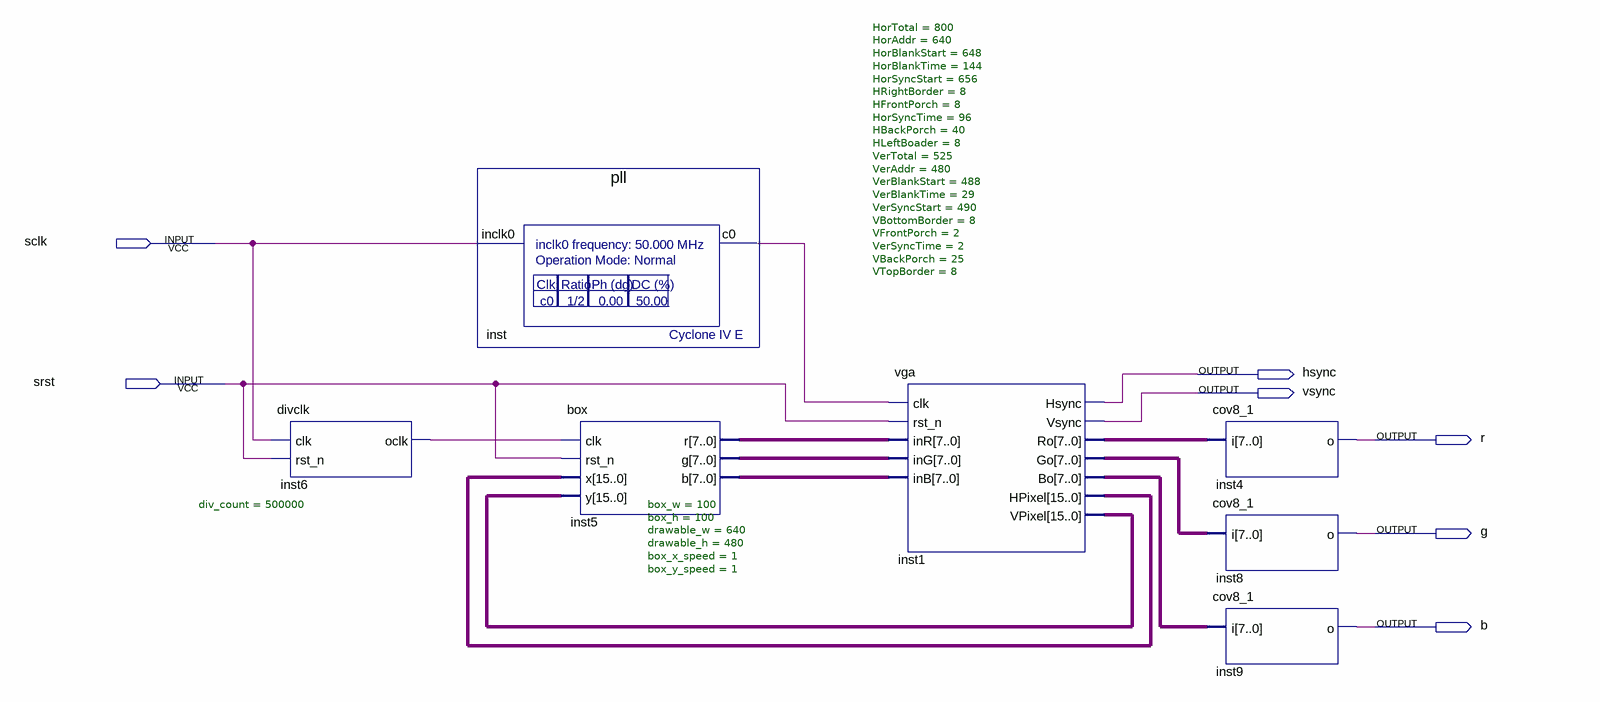
[diagram p0: schematic sheet]
// Quartus schematic box_move.bdf as structural Verilog: 7 symbols, 7 pins
module box_move (
  input  sclk,
  input  srst,
  output hsync,
  output vsync,
  output r,
  output g,
  output b
);

  wire inst6_oclk, inst_c0;
  wire [7:0] inst1_bo, inst1_go, inst1_ro, inst5_b, inst5_g, inst5_r;
  wire [15:0] inst1_hpixel, inst1_vpixel;

  divclk #(.div_count(500000)) inst6 (.clk(sclk), .rst_n(srst), .oclk(inst6_oclk));
  pll inst (.inclk0(sclk), .c0(inst_c0));
  box #(.box_w(100), .box_h(100), .drawable_w(640), .drawable_h(480), .box_x_speed(1), .box_y_speed(1)) inst5 (
    .clk(inst6_oclk), .rst_n(srst), .x(inst1_hpixel), .y(inst1_vpixel), .r(inst5_r), .g(inst5_g), .b(inst5_b));
  vga #(.HorTotal(800), .HorAddr(640), .HorBlankStart(648), .HorBlankTime(144), .HorSyncStart(656), .HRightBorder(8), .HFrontPorch(8), .HorSyncTime(96), .HBackPorch(40), .HLeftBoader(8), .VerTotal(525), .VerAddr(480), .VerBlankStart(488), .VerBlankTime(29), .VerSyncStart(490), .VBottomBorder(8), .VFrontPorch(2), .VerSyncTime(2), .VBackPorch(25), .VTopBorder(8)) inst1 (
    .clk(inst_c0), .rst_n(srst), .inR(inst5_r), .inG(inst5_g), .inB(inst5_b), .Hsync(hsync), .Vsync(vsync),
    .Ro(inst1_ro), .Go(inst1_go), .Bo(inst1_bo), .HPixel(inst1_hpixel), .VPixel(inst1_vpixel));
  cov8_1 inst4 (.i(inst1_ro), .o(r));
  cov8_1 inst8 (.i(inst1_go), .o(g));
  cov8_1 inst9 (.i(inst1_bo), .o(b));
endmodule
